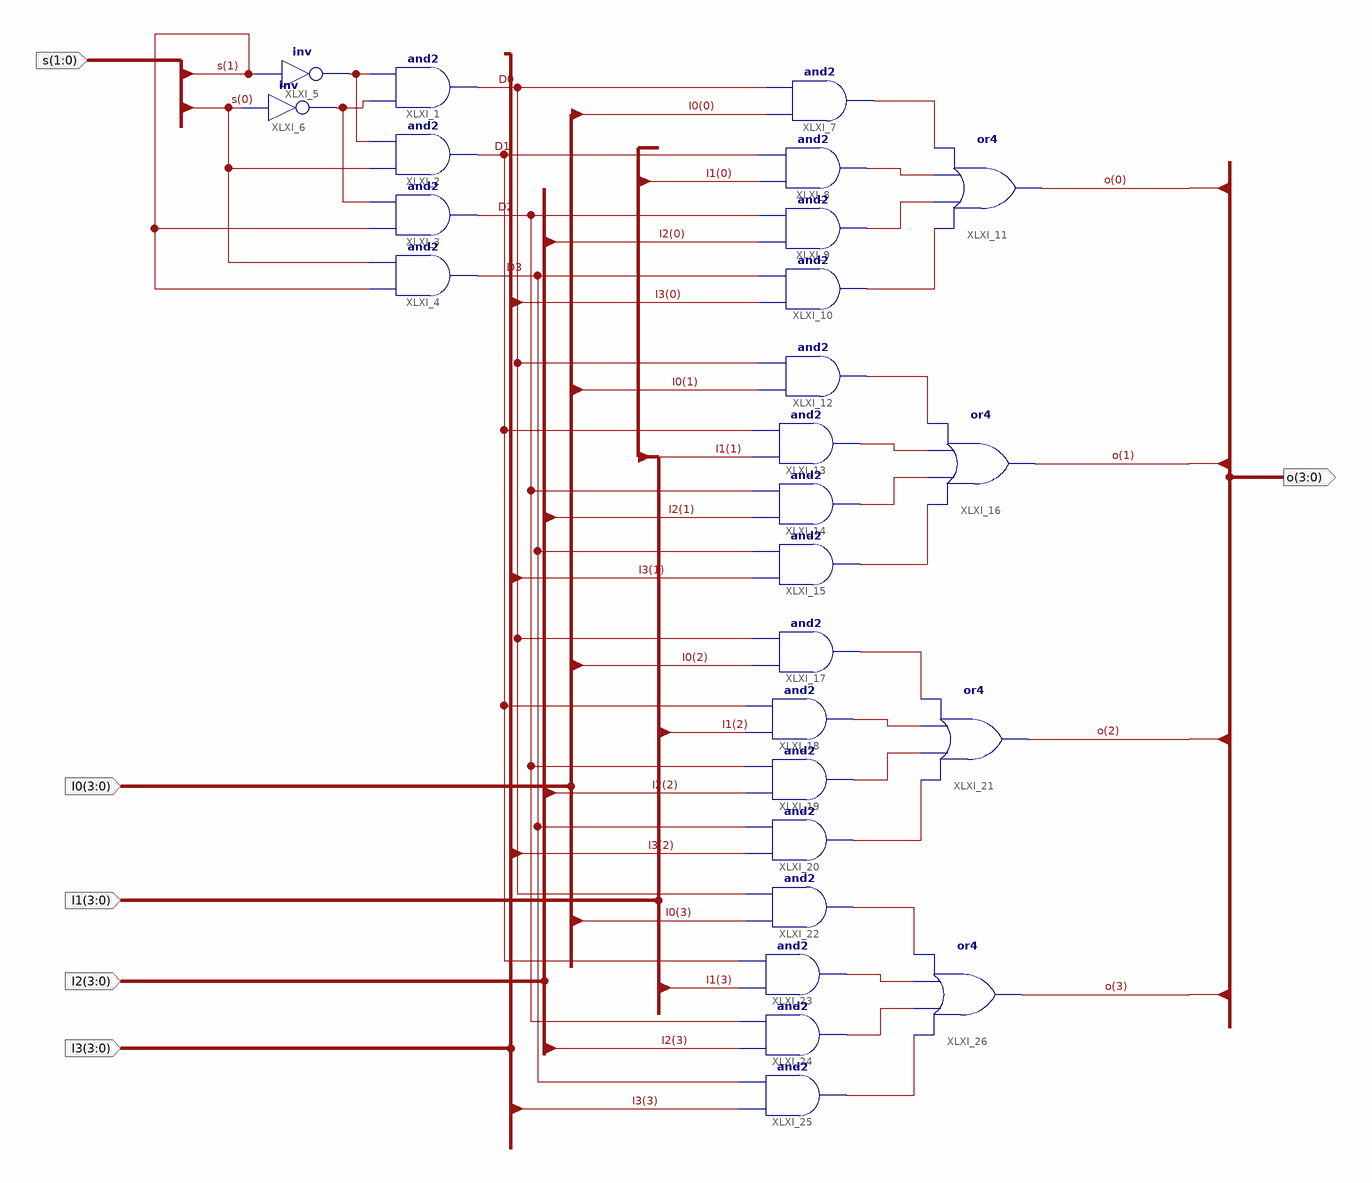
[diagram p0: schematic sheet 1]
// Xilinx ISE schematic Mux4to1b4.sch (kintex7) as structural Verilog: 26 symbols, 6 ports
module Mux4to1b4 (
  input  [1:0] s,
  input  [3:0] I0,
  input  [3:0] I2,
  input  [3:0] I3,
  input  [3:0] I1,
  output [3:0] o
);

  wire D0, D1, D2, D3, ns0, ns1, XLXN_14, XLXN_15, XLXN_16, XLXN_17, XLXN_20, XLXN_21, XLXN_22, XLXN_23,
       XLXN_24, XLXN_25, XLXN_26, XLXN_27, XLXN_28, XLXN_29, XLXN_30, XLXN_31;

  and XLXI_1 (D0, ns0, ns1);
  and XLXI_2 (D1, s[0], ns1);
  and XLXI_3 (D2, s[1], ns0);
  and XLXI_4 (D3, s[1], s[0]);
  not XLXI_5 (ns1, s[1]);
  not XLXI_6 (ns0, s[0]);
  and XLXI_7 (XLXN_14, I0[0], D0);
  and XLXI_8 (XLXN_15, I1[0], D1);
  and XLXI_9 (XLXN_16, I2[0], D2);
  and XLXI_10 (XLXN_17, I3[0], D3);
  or XLXI_11 (o[0], XLXN_17, XLXN_16, XLXN_15, XLXN_14);
  and XLXI_12 (XLXN_20, I0[1], D0);
  and XLXI_13 (XLXN_21, I1[1], D1);
  and XLXI_14 (XLXN_22, I2[1], D2);
  and XLXI_15 (XLXN_23, I3[1], D3);
  or XLXI_16 (o[1], XLXN_23, XLXN_22, XLXN_21, XLXN_20);
  and XLXI_17 (XLXN_24, I0[2], D0);
  and XLXI_18 (XLXN_25, I1[2], D1);
  and XLXI_19 (XLXN_26, I2[2], D2);
  and XLXI_20 (XLXN_27, I3[2], D3);
  or XLXI_21 (o[2], XLXN_27, XLXN_26, XLXN_25, XLXN_24);
  and XLXI_22 (XLXN_28, I0[3], D0);
  and XLXI_23 (XLXN_29, I1[3], D1);
  and XLXI_24 (XLXN_30, I2[3], D2);
  and XLXI_25 (XLXN_31, I3[3], D3);
  or XLXI_26 (o[3], XLXN_31, XLXN_30, XLXN_29, XLXN_28);
endmodule
